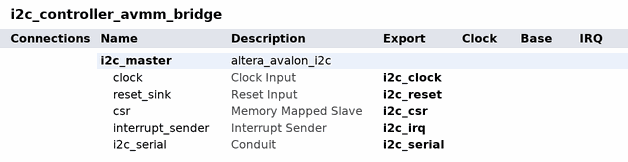
[diagram p0: system contents]
# Platform Designer (Qsys) system i2c_controller_avmm_bridge, MAX 10 10M25DAF256C8G
# Parameters at their usual value, and those the tool derives, are not listed.
package require -exact qsys 21.1
create_system i2c_controller_avmm_bridge
set_project_property DEVICE_FAMILY {MAX 10}
set_project_property DEVICE 10M25DAF256C8G

add_instance i2c_master altera_avalon_i2c 21.1
set_instance_parameter_value i2c_master FIFO_DEPTH 64

# exported interfaces
add_interface i2c_clock clock sink
set_interface_property i2c_clock EXPORT_OF i2c_master.clock
add_interface i2c_csr avalon slave
set_interface_property i2c_csr EXPORT_OF i2c_master.csr
add_interface i2c_irq interrupt sender
set_interface_property i2c_irq EXPORT_OF i2c_master.interrupt_sender
add_interface i2c_reset reset sink
set_interface_property i2c_reset EXPORT_OF i2c_master.reset_sink
add_interface i2c_serial conduit end
set_interface_property i2c_serial EXPORT_OF i2c_master.i2c_serial

set_interconnect_requirement {$system} qsys_mm.clockCrossingAdapter HANDSHAKE
set_interconnect_requirement {$system} qsys_mm.enableEccProtection FALSE
set_interconnect_requirement {$system} qsys_mm.insertDefaultSlave FALSE
set_interconnect_requirement {$system} qsys_mm.maxAdditionalLatency 1

save_system i2c_controller_avmm_bridge.qsys
